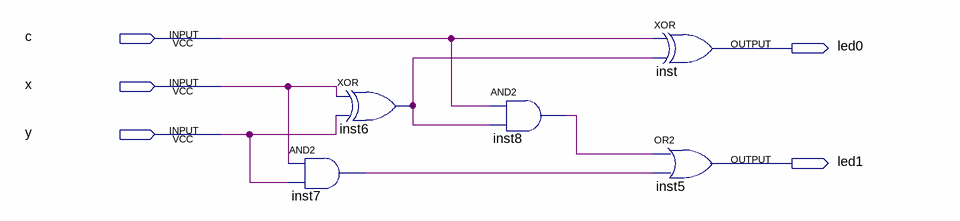
[diagram p0: schematic sheet]
// Quartus schematic aula05.bdf as structural Verilog: 5 symbols, 5 pins
module aula05 (
  input  c,
  input  x,
  input  y,
  output led0,
  output led1
);

  wire inst6_out, inst7_out, inst8_out;

  and inst7 (inst7_out, x, y);
  xor inst6 (inst6_out, x, y);
  and inst8 (inst8_out, c, inst6_out);
  xor inst (led0, c, inst6_out);
  or inst5 (led1, inst8_out, inst7_out);
endmodule
